# EAGLE design lp_propeller (EAGLE 6.6.0)
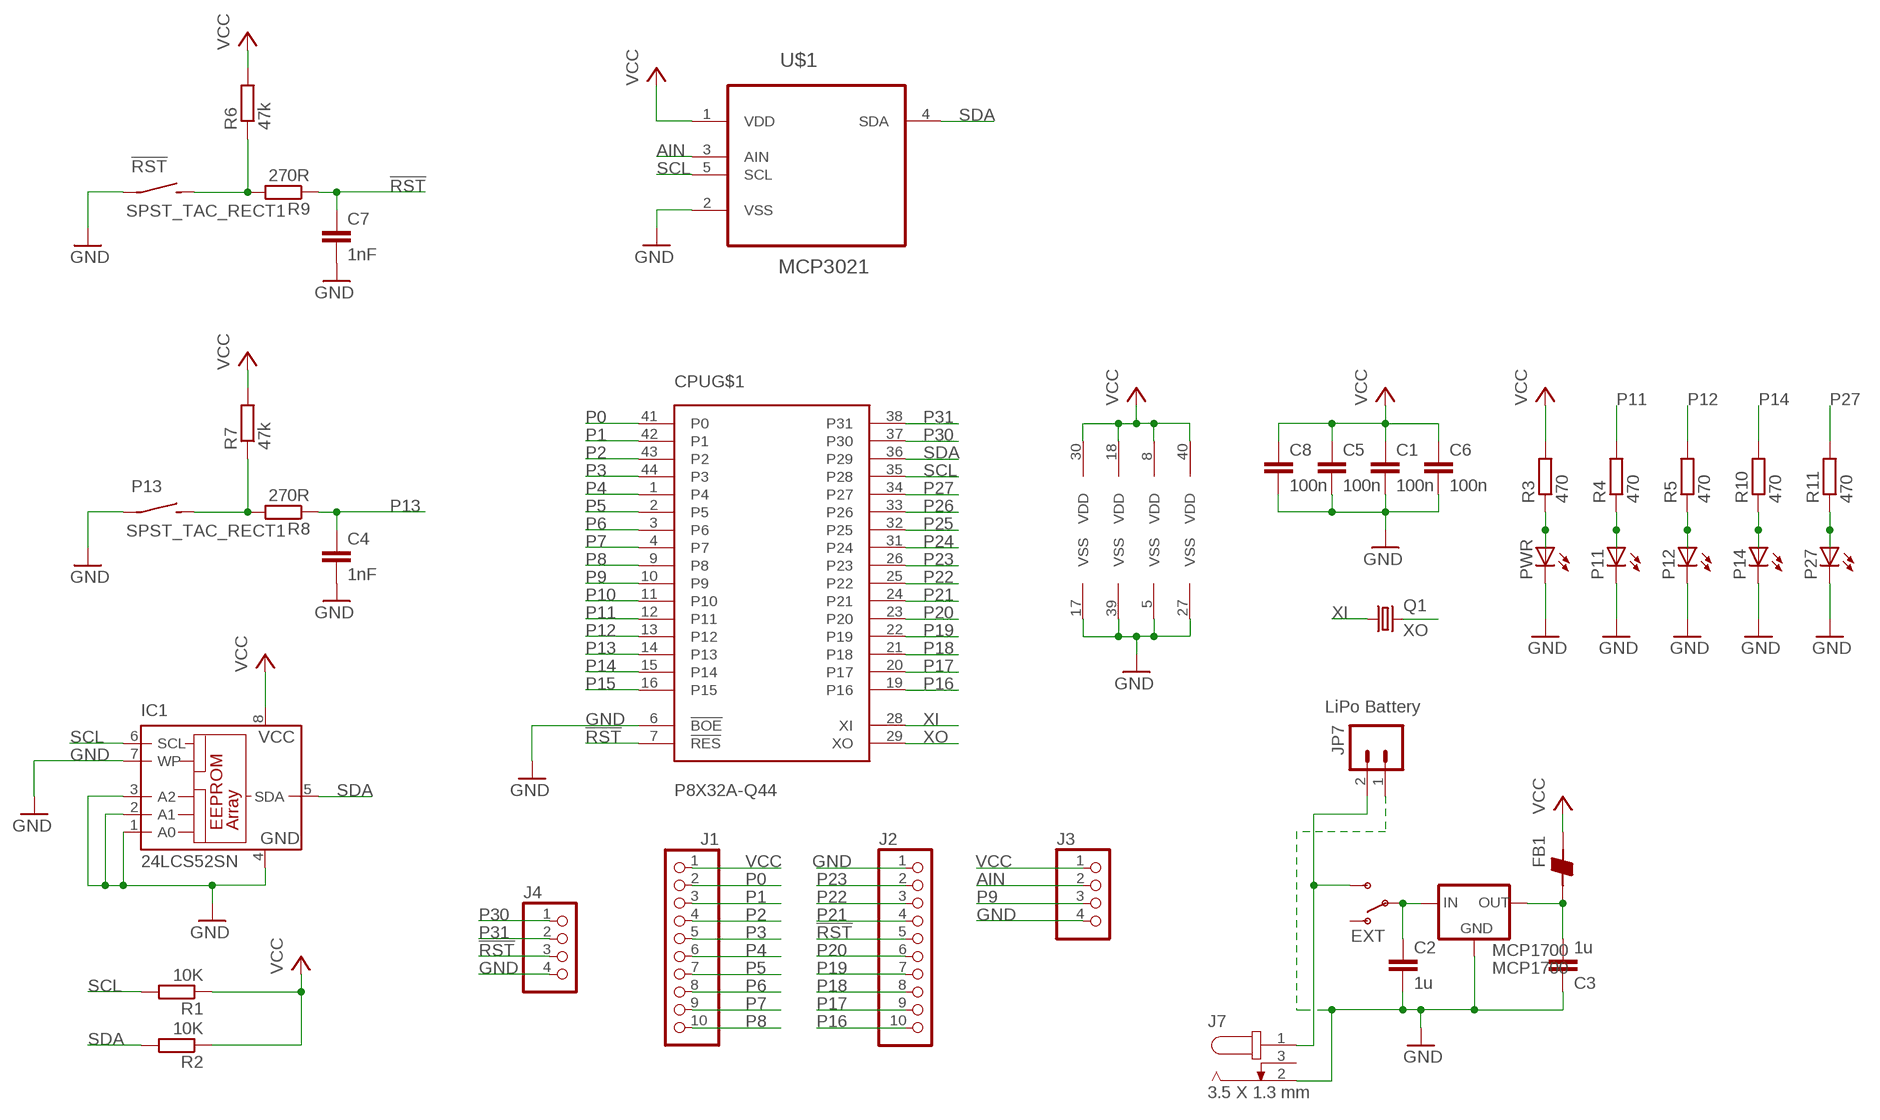
[diagram p0: schematic, sheet 1]

## Parts
!RST  SPST_TAC_RECT1  [6MMTACTILE_RECT]
C1  100n  C-EUC0805  [C0805]
C2  1u  C-EUC0805  [C0805]
C3  1u  C-EUC0805  [C0805]
C4  1nF  C-EUC0805  [C0805]
C5  100n  C-EUC0805  [C0805]
C6  100n  C-EUC0805  [C0805]
C7  1nF  C-EUC0805  [C0805]
C8  100n  C-EUC0805  [C0805]
CPU  P8X32A-Q44  [LQFP-44]
FB1  BEAD-0805  [0805]
IC1  24LCS52SN  [SO-08]
J1  PH1X10OCT076  [PH1X10OCT76]
J2  PH1X10OCT076  [PH1X10OCT76]
J3  PINHD-1X4  [1X04]
J4  PINHD-1X4  [1X04]
J7  3.5 X 1.3 mm  DC_JACK_3.5X1.3MM  [3.5X1.3MM_DC_JACK]
JP7  LiPo Battery  M02JST-PTH-2  [JST-2-PTH]
MCP1700  MCP1700  MCP1700SOT-23  [SOT-23]
ON  EXT  SWITCH-SPSTPTH  [SWITCH-SPDT]
P11  LEDCHIPLED_1206  [CHIPLED_1206]
P12  LEDCHIPLED_1206  [CHIPLED_1206]
P13  SPST_TAC_RECT1  [6MMTACTILE_RECT]
P14  LEDCHIPLED_1206  [CHIPLED_1206]
P27  LEDCHIPLED_1206  [CHIPLED_1206]
PWR  LEDCHIPLED_1206  [CHIPLED_1206]
Q1  CRYSTALHC49S  [HC49/S]
R1  10K  R-EU_R0805  [R0805]
R2  10K  R-EU_R0805  [R0805]
R3  470  R-EU_R0805  [R0805]
R4  470  R-EU_R0805  [R0805]
R5  470  R-EU_R0805  [R0805]
R6  47k  R-EU_R0805  [R0805]
R7  47k  R-EU_R0805  [R0805]
R8  270R  R-EU_R0805  [R0805]
R9  270R  R-EU_R0805  [R0805]
R10  470  R-EU_R0805  [R0805]
R11  470  R-EU_R0805  [R0805]
U$1  MCP3021  MCP3021A5T-E/OT  [SOT95P270X145-5N]

## Nets
!RST: C7.1 CPU.7(!RES) J2.5 J4.3 R9.1
AIN: J3.2 U$1.3(AIN)
GND [GND]: !RST.P$1(P) C1.2 C2.2 C3.1 C4.2 C5.2 C6.2 C7.2 C8.2 CPU.5(VSS) CPU.6(!BOE) CPU.17(VSS) CPU.27(VSS) CPU.39(VSS) IC1.1(A0) IC1.2(A1) IC1.3(A2) IC1.4(GND) IC1.7(WP) J2.1 J3.4 J4.4 J7.2 JP7.1 MCP1700.1(GND) P11.C P12.C P13.P$1(P) P14.C P27.C PWR.C U$1.2(VSS)
N$1: P14.A R10.1
N$2: P27.A R11.1
N$3 [VCC]: C2.1 MCP1700.3(IN) ON.2(P)
N$4: PWR.A R3.1
N$5: P13.P$2(S) R7.1 R8.2
N$6 [VCC]: C3.2 FB1.1 MCP1700.2(OUT)
N$9: P11.A R4.1
N$10: P12.A R5.1
N$11: !RST.P$2(S) R6.1 R9.2
P0: CPU.41(P0) J1.2
P1: CPU.42(P1) J1.3
P2: CPU.43(P2) J1.4
P3: CPU.44(P3) J1.5
P4: CPU.1(P4) J1.6
P5: CPU.2(P5) J1.7
P6: CPU.3(P6) J1.8
P7: CPU.4(P7) J1.9
P8: CPU.9(P8) J1.10
P9: CPU.10(P9) J3.3
P10: CPU.11(P10)
P11: CPU.12(P11) R4.2
P12: CPU.13(P12) R5.2
P13: C4.1 CPU.14(P13) R8.1
P14: CPU.15(P14) R10.2
P15: CPU.16(P15)
P16: CPU.19(P16) J2.10
P17: CPU.20(P17) J2.9
P18: CPU.21(P18) J2.8
P19: CPU.22(P19) J2.7
P20: CPU.23(P20) J2.6
P21: CPU.24(P21) J2.4
P22: CPU.25(P22) J2.3
P23: CPU.26(P23) J2.2
P24: CPU.31(P24)
P25: CPU.32(P25)
P26: CPU.33(P26)
P27: CPU.34(P27) R11.2
P30: CPU.37(P30) J4.1
P31: CPU.38(P31) J4.2
SCL: CPU.35(P28) IC1.6(SCL) R1.2 U$1.5(SCL)
SDA: CPU.36(P29) IC1.5(SDA) R2.2 U$1.4(SDA)
VCC [VCC]: C1.1 C5.1 C6.1 C8.1 CPU.8(VDD) CPU.18(VDD) CPU.30(VDD) CPU.40(VDD) FB1.2 IC1.8(VCC) J1.1 J3.1 R1.1 R2.1 R3.2 R6.2 R7.2 U$1.1(VDD)
VCCEXT [VCC]: J7.1 JP7.2 ON.3(S)
XI: CPU.28(XI) Q1.1
XO: CPU.29(XO) Q1.2
Unconnected: J7.3 ON.1(O)

## Library data of the parts
!RST P13 = bt_electromech:SPST: SPST SWITCH
C1-C3 C5 C6 C8 = rcl:C-EU: CAPACITOR, European symbol
C4 C7 = resistor:C-EU: CAPACITOR, European symbol
CPU = parallax_propeller:P8X32A-Q44: Parallax Propeller P8X32A-Q44 44 Pin LQFP 32-bit Microprocessor http://www.parallax.com/propeller/
FB1 = CH_passive:BEAD
IC1 = microchip:24*: Serial EEPROM I2C; MF: MICROCHIP; MPN: 24LCS52-I/SN; OC_FARNELL: 1816066; OC_NEWARK: 92C7032
J1 J2 = MY_CONN:PH1X10
J3 J4 = pinhead:PINHD-1X4: PIN HEADER
J7 = MY_CONN:DC_JACK_3.5X1.3MM
JP7 = SparkFun:M02: Header 2 Standard 2-pin 0.1" header. Use with straight break away headers (SKU : PRT-00116), right angle break away headers (PRT-00553), swiss pins (PRT-00743), machine pins (PRT-00117), and female headers (PRT-00115). Molex polarized connector foot print use with SKU : PRT-08233 with associated crimp pins and housings.
MCP1700 = MY_IC:MCP1700
ON = SparkFun:SWITCH-SPST: SPST Switch Simple slide switch. Spark Fun Electronics SKU : COM-00102
P11 P12 P14 P27 PWR = led:LED: LED OSRAM: - CHIPLED LG R971, LG N971, LY N971, LG Q971, LY Q971, LO R971, LY R971 LH N974, LH R974 LS Q976, LO Q976, LY Q976 LO Q996 - Hyper CHIPLED LW Q18S LB Q993, LB Q99A, LB R99A - SideLED LS A670, LO A670, LY A670, LG A670, LP A670 LB A673, LV A673, LT A673, LW A673 LH A674 LY A675 LS A676, LA A676, LO A676, LY A676, LW A676 LS A679, LY A679, LG A679 - Hyper Micro SIDELED® LS Y876, LA Y876, LO Y876, LY Y876 LT Y87S - SmartLED LW L88C, LW L88S LB L89C, LB L89S, LG L890 LS L89K, LO L89K, LY L89K LS L896, LA L896, LO L896, LY L896 - TOPLED LS T670, LO T670, LY T670, LG T670, LP T670 LSG T670, LSP T670, LSY T670, LOP T670, LYG T670 LG T671, LOG T671, LSG T671 LB T673, LV T673, LT T673, LW T673 LH T674 LS T676, LA T676, LO T676, LY T676, LB T676, LH T676, LSB T676, LW T676 LB T67C, LV T67C, LT T67C, LS T67K, LO T67K, LY T67K, LW E67C LS E67B, LA E67B, LO E67B, LY E67B, LB E67C, LV E67C, LT E67C LW T67C LS T679, LY T679, LG T679 LS T770, LO T770, LY T770, LG T770, LP T770 LB T773, LV T773, LT T773, LW T773 LH T774 LS E675, LA E675, LY E675, LS T675 LS T776, LA T776, LO T776, LY T776, LB T776 LHGB T686 LT T68C, LB T68C - Hyper Mini TOPLED® LB M676 - Mini TOPLED Santana® LG M470 LS M47K, LO M47K, LY M47K Source: http://www.osram.convergy.de LUXEON: - LUMILED® LXK2-PW12-R00, LXK2-PW12-S00, LXK2-PW14-U00, LXK2-PW14-V00 LXK2-PM12-R00, LXK2-PM12-S00, LXK2-PM14-U00 LXK2-PE12-Q00, LXK2-PE12-R00, LXK2-PE12-S00, LXK2-PE14-T00, LXK2-PE14-U00 LXK2-PB12-K00, LXK2-PB12-L00, LXK2-PB12-M00, LXK2-PB14-N00, LXK2-PB14-P00, LXK2-PB14-Q00 LXK2-PR12-L00, LXK2-PR12-M00, LXK2-PR14-Q00, LXK2-PR14-R00 LXK2-PD12-Q00, LXK2-PD12-R00, LXK2-PD12-S00 LXK2-PH12-R00, LXK2-PH12-S00 LXK2-PL12-P00, LXK2-PL12-Q00, LXK2-PL12-R00 Source: www.luxeon.com KINGBRIGHT: KA-3528ASYC Source: www.kingbright.com
Q1 = crystal:CRYSTAL: CRYSTAL; OC_FARNELL: 1667008; OC_NEWARK: unknown
R1-R11 = resistor:R-EU_: RESISTOR, European symbol
U$1 = thierry_eagle:MCP3021A5T-E/OT: A/D Converter; MPN: MCP3021A5T-E/OT; OC_FARNELL: 1332097; OC_NEWARK: 34M7445; PACKAGE: SOT-5; SUPPLIER: Microchip

## Net classes
0 default: width 0.406 mm, drill 0.508 mm
1 GND: width 0.508 mm, drill 0.508 mm
2 VCC: width 1.016 mm, drill 0.508 mm
4 VCCEXT: width 0.762 mm, drill 0.508 mm

## Board
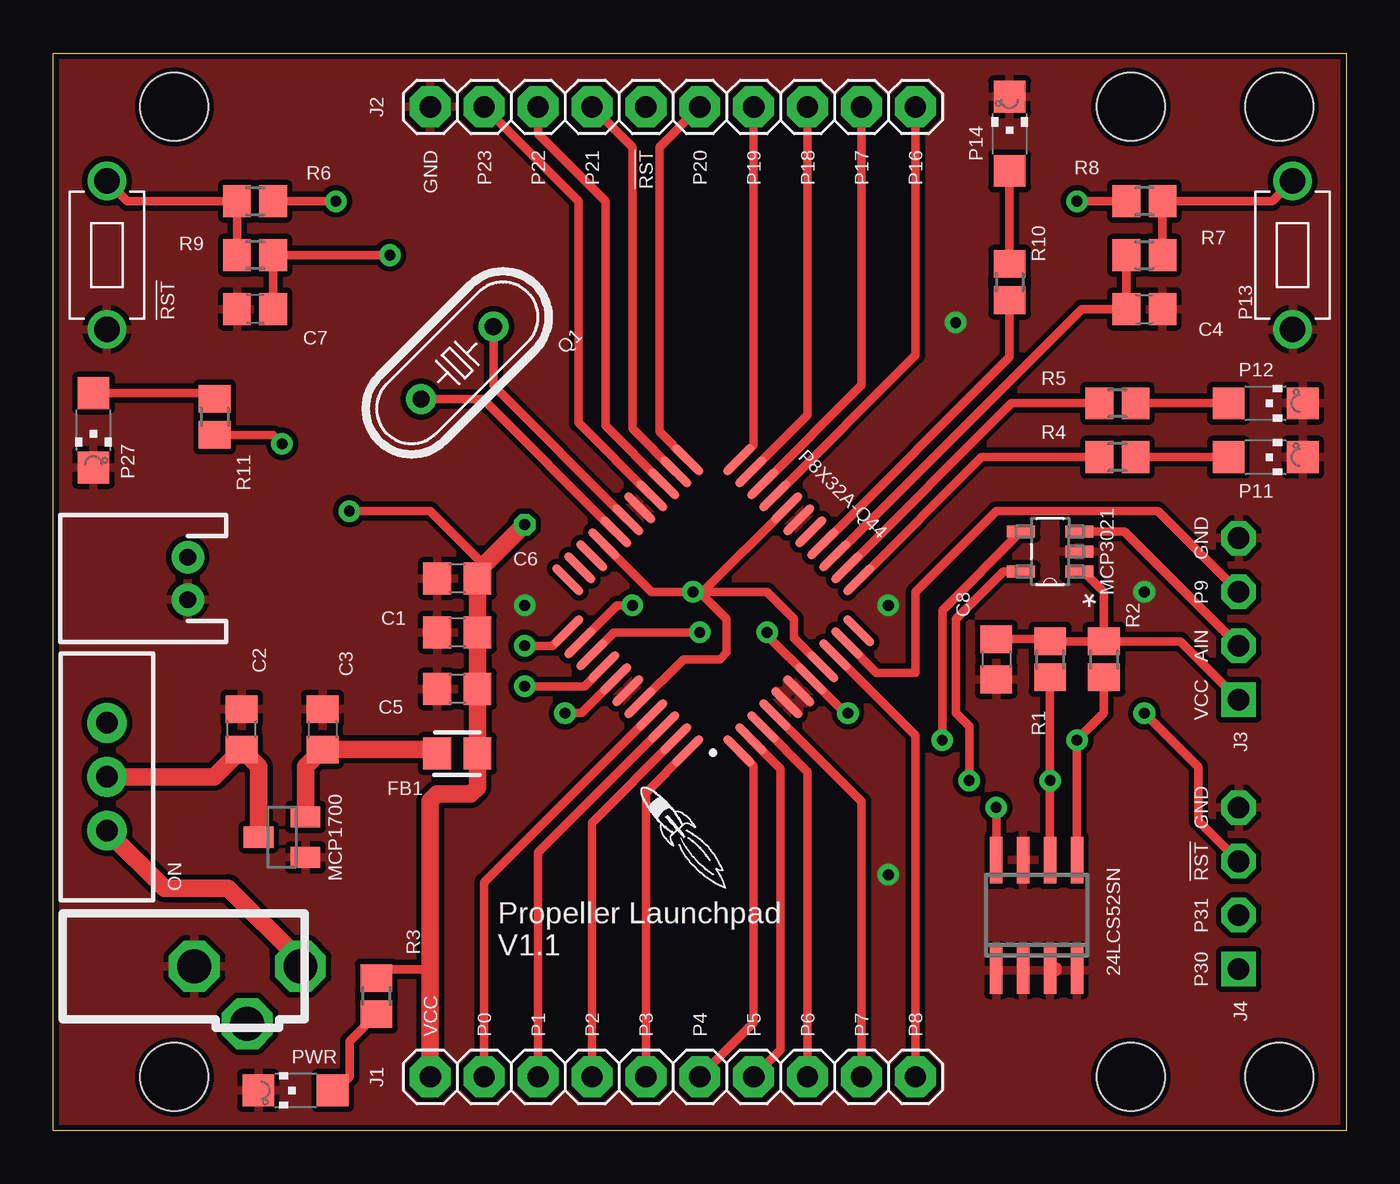
[diagram p1: board, top side]
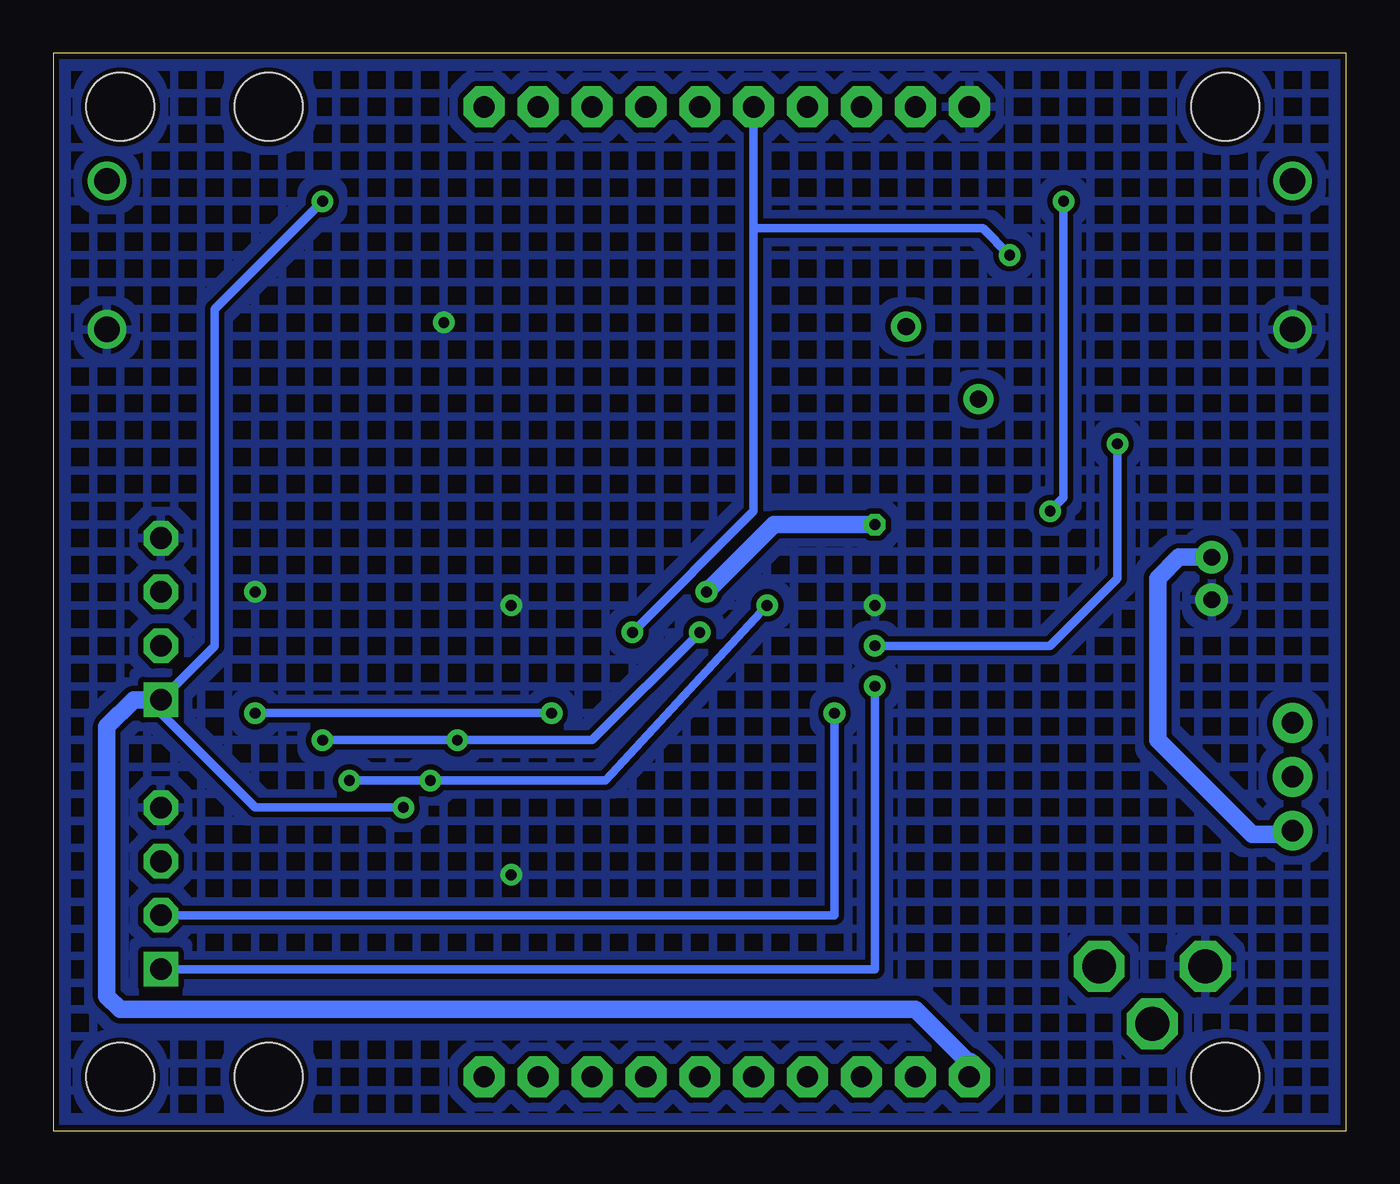
[diagram p2: board, bottom side, seen from below]

Size 60.96 x 50.8 mm. Coordinates in mm from the lower left corner, seen from the top.
Outline: 0,50.8 60.96,50.8 60.96,0 0,0 0,50.8
Copper layers (1*16): Top 0.035mm / dielectric 1.5mm / Bottom 0.035mm
Design rules "SparkFun *": minimum track width 8mil, minimum drill 20mil, track to track 7mil, track to pad 7mil, pad to pad 7mil, via to via 7mil, smd to smd 7mil, copper to edge 7mil, drill to drill 7mil, minimum pad ring 12mil, minimum via ring 10mil, stop-mask expansion 4mil, vias tented up to drill 25mil, thermal gap 10mil
Holes 3.2 mm at 5.71,48.26 50.8,48.26 50.8,2.54 5.71,2.54 57.79,2.54 57.79,48.26

### Footprints (pad centres in the part's own frame; a part is rotated, then mirrored left to right if it is on the bottom)
6MMTACTILE_RECT = drill 1.2: P$1 -3.5,0; P$2 3.5,0
C0805 = smd 1.3 x 1.5: 1 -0.95,0; 2 0.95,0
C0805' = smd 1.3 x 1.5: 1 -0.85,0; 2 0.85,0
LQFP-44 = smd 1.9 x 0.4: 1 -5.7,4; 2 -5.7,3.2; 3 -5.7,2.4; 4 -5.7,1.6; 5 -5.7,0.8; 6 -5.7,0; 7 -5.7,-0.8; 8 -5.7,-1.6; 9 -5.7,-2.4; 10 -5.7,-3.2; 11 -5.7,-4; 23 5.7,-4; 24 5.7,-3.2; 25 5.7,-2.4; 26 5.7,-1.6; 27 5.7,-0.8; 28 5.7,0; 29 5.7,0.8; 30 5.7,1.6; 31 5.7,2.4; 32 5.7,3.2; 33 5.7,4 | smd 0.4 x 1.9: 12 -4,-5.7; 13 -3.2,-5.7; 14 -2.4,-5.7; 15 -1.6,-5.7; 16 -0.8,-5.7; 17 0,-5.7; 18 0.8,-5.7; 19 1.6,-5.7; 20 2.4,-5.7; 21 3.2,-5.7; 22 4,-5.7; 34 4,5.7; 35 3.2,5.7; 36 2.4,5.7; 37 1.6,5.7; 38 0.8,5.7; 39 0,5.7; 40 -0.8,5.7; 41 -1.6,5.7; 42 -2.4,5.7; 43 -3.2,5.7; 44 -4,5.7
0805 = smd 1.3 x 1.5: 1 -0.95,0; 2 0.95,0
SO-08 = smd 0.6 x 2.2: 1 -1.905,-2.6; 2 -0.635,-2.6; 3 0.635,-2.6; 4 1.905,-2.6; 5 1.905,2.6; 6 0.635,2.6; 7 -0.635,2.6; 8 -1.905,2.6
PH1X10OCT76 = drill 1 pad 1.93 octagon: 1 0,0; 2 2.54,0; 3 5.08,0; 4 7.62,0; 5 10.16,0; 6 12.7,0; 7 15.24,0; 8 17.78,0; 9 20.32,0; 10 22.86,0
1X04 = drill 1.016 square: 1 -3.81,0 | drill 1.016 octagon: 2 -1.27,0; 3 1.27,0; 4 3.81,0
3.5X1.3MM_DC_JACK = drill 1.6 octagon: 1 0,0; 2 -5,0; 3 -2.5,-2.7
JST-2-PTH = drill 0.787 pad 1.524: 1 -1,0; 2 1,0
SOT-23 = smd 1 x 1.4: 1 -0.95,-1.1; 2 0.95,-1.1; 3 0,1.1
SWITCH-SPDT = drill 1.016 pad 1.88: 1 0,2.54; 2 0,0; 3 0,-2.54
CHIPLED_1206 = smd 1.5 x 1.5: A 0,-1.75; C 0,1.75
HC49/S = drill 0.813: 1 -2.413,0; 2 2.413,0
R0805 = smd 1.3 x 1.5: 1 -0.85,0; 2 0.85,0
SOT95P270X145-5N = smd 1.321 x 0.559: 1 -1.372,0.94; 2 -1.372,0; 3 -1.372,-0.94; 4 1.372,-0.94; 5 1.372,0.94

### Placement (x,y rotation side)
!RST  2.54,41.27 90 top
C1  19.05,20.83 180 top
C2  8.89,18.92 90 top
C3  12.7,18.92 270 top
C4  1nF  [C0805']  51.43,38.73 0 top
C5  19.05,23.49 180 top
C6  19.05,26.04 180 top
C7  1nF  [C0805']  9.52,38.73 180 top
C8  44.45,22.22 270 top
CPU  31.12,24.76 135 top
FB1  19.05,17.78 0 top
IC1  46.35,10.16 0 top
J1  17.78,2.54 0 top
J2  17.78,48.26 0 top
J3  55.88,24.13 90 top
J4  55.88,11.43 90 top
J7  11.66,7.75 0 top
JP7  6.35,26.04 90 top
MCP1700  10.8,13.84 90 top
ON  2.54,16.69 0 top
P11  57.15,31.75 270 top
P12  57.15,34.29 270 top
P13  58.42,41.27 90 top
P14  45.09,46.99 0 top
P27  1.9,33.02 180 top
PWR  11.43,1.91 90 top
Q1  19.05,36.2 225 top
R1  46.99,22.22 270 top
R2  49.53,22.22 270 top
R3  15.24,6.35 90 top
R4  50.16,31.75 180 top
R5  50.16,34.29 180 top
R6  9.52,43.82 0 top
R7  51.43,43.82 180 top
R8  51.43,41.27 0 top
R9  9.52,41.27 180 top
R10  45.09,40.01 270 top
R11  7.62,33.66 270 top
U$1  46.99,27.3 180 top
U$2  [LOGO-ROCKET]  29.53,13.97 90 top

### Tracks (layer width: path | path; a pad name or v marks a point on that pad's centre or on a via)
!RST  (via drill 0.51)
  Top 0.406: C7.1 R9.1 v15.88,41.27 | v33.66,23.49 33.66,23.36 CPU.7 37.33,19.68 v37.46,19.68 | v51.43,19.68 53.98,17.14 53.98,14.61 J4.3
  Bottom 0.406: v33.66,23.49 27.94,29.21 27.94,42.55 | 27.94,42.55 J2.5 | v15.88,41.27 17.14,42.55 27.94,42.55 | v37.46,19.68 v51.43,19.68
AIN
  Top 0.406: J3.2 50.49,28.24 U$1.3
GND  (via drill 0.51)
  Top 0.508: 47.27,7.56 47.27,7.7 IC1.3
  other vias: 39.37,12.06 22.23,24.76 39.37,24.76 51.43,25.4 42.54,38.1
  pour Top (isolate 0.254): -0.89,-0.51 61.98,-0.51 61.98,51.31 -0.89,51.31
  pour Bottom (isolate 0.254, hatched): -0.89,-0.51 61.98,-0.51 61.98,51.31 -0.89,51.31
N$1
  Top 0.406: R10.1 P14.A
N$2
  Top 0.406: R11.1 7.35,34.77 P27.A
N$3
  Top 0.813: MCP1700.3 9.7,17.17 C2.1 7.6,16.69 ON.2
N$4
  Top 0.406: R3.1 13.97,4.23 13.97,2.54 13.34,1.91 PWR.A
N$5
  Top 0.406: P13.P$2 57.46,43.82 R7.1 R8.2
N$6
  Top 0.813: 17.91,17.97 C3.2 11.89,17.17 MCP1700.2
  Top 1.016: FB1.1 17.91,17.97
N$9
  Top 0.406: R4.1 P11.A
N$10
  Top 0.406: R5.1 P12.A
N$11
  Top 0.406: !RST.P$2 3.5,43.82 R6.1 R9.2
P0
  Top 0.406: CPU.41 20.32,11.71 J1.2
P1
  Top 0.406: CPU.42 22.86,13.12 J1.3
P2
  Top 0.406: CPU.43 25.4,14.53 J1.4
P3
  Top 0.406: CPU.44 27.94,15.93 J1.5
P4
  Top 0.406: CPU.1 33.02,17.2 33.02,5.08 J1.6
P5
  Top 0.406: CPU.2 34.29,17.06 34.29,3.81 J1.7
P6
  Top 0.406: CPU.3 35.56,16.93 J1.8
P7
  Top 0.406: CPU.4 38.1,15.52 J1.9
P8
  Top 0.406: CPU.9 40.64,18.63 J1.10
P9
  Top 0.406: CPU.10 38.81,21.59 40.64,21.59 40.64,25.4 44.45,29.21 52.07,29.21 J3.3
P11
  Top 0.406: CPU.12 43.76,31.75 R4.2
P12
  Top 0.406: CPU.13 45.16,34.29 R5.2
P13
  Top 0.406: R8.1 C4.1 48.48,38.73 CPU.14
P14
  Top 0.406: CPU.15 45.09,36.47 R10.2
P16
  Top 0.406: CPU.19 40.64,36.55 J2.10
P17
  Top 0.406: CPU.20 38.1,35.14 J2.9
P18
  Top 0.406: CPU.21 35.56,33.73 J2.8
P19
  Top 0.406: CPU.22 33.02,32.33 J2.7
P20
  Top 0.406: CPU.23 28.57,32.96 28.57,46.36 J2.6
P21
  Top 0.406: CPU.24 27.3,33.1 27.3,46.36 J2.4
P22
  Top 0.406: CPU.25 26.03,33.24 26.03,43.82 22.86,46.99 J2.3
P23
  Top 0.406: CPU.26 24.77,33.38 24.77,43.82 J2.2
P27  (via drill 0.51)
  Top 0.406: CPU.34 23.55,22.86 v22.23,22.86 | v10.8,32.39 10.38,32.8 R11.2
  Bottom 0.406: v22.23,22.86 13.97,22.86 10.8,26.04 v10.8,32.39
P30  (via drill 0.51)
  Top 0.406: CPU.37 25.04,20.95 v22.23,20.95
  Bottom 0.406: v22.23,20.95 22.23,7.62 J4.1
P31  (via drill 0.51)
  Top 0.406: CPU.38 24.9,19.68 v24.13,19.68
  Bottom 0.406: v24.13,19.68 24.13,10.16 J4.2
SCL  (via drill 0.51)
  Top 0.406: CPU.35 26.59,24.76 v27.3,24.76 | IC1.6 v46.99,16.51 R1.2 | U$1.5 44.78,26.36 42.54,24.13 42.54,19.68 43.18,19.05 v43.18,16.51
  Bottom 0.406: v27.3,24.76 34.92,16.51 v43.18,16.51 v46.99,16.51
SDA  (via drill 0.51)
  Top 0.406: IC1.5 v48.26,18.41 49.53,19.68 R2.2 | CPU.36 26.45,23.49 v30.48,23.49 | U$1.4 41.91,24.54 v41.91,18.41
  Bottom 0.406: v30.48,23.49 35.56,18.41 v41.91,18.41 v48.26,18.41
VCC  (via drill 0.51)
  Top 0.406: C6.1 20.32,26.04 20.32,26.67 17.78,29.21 v13.97,29.21 | R2.1 53.12,23.07 J3.1 | R2.1 R1.1 46.89,23.17 C8.1 | v13.34,43.82 R6.2 | R3.2 15.66,7.62 17.78,7.62 | R7.2 v48.26,43.82 | IC1.8 v44.45,15.24 | R2.1 49.53,25.4 48.57,26.36 U$1.1 | CPU.40 29.71,22.22 31.43,22.22 31.75,22.54 31.75,24.13 30.48,25.4 v30.16,25.4 | CPU.18 30.62,25.4 v30.16,25.4 | CPU.30 28.22,25.4 v30.16,25.4 | CPU.8 34.92,23.22 34.92,24.13 33.66,25.4 v30.16,25.4
  Top 0.813: C6.1 C5.1 C1.1 FB1.2 20,16.19 19.68,15.88 18.09,15.88 17.78,15.56 17.78,7.62 J1.1 | 20.32,26.67 v22.23,28.57
  Bottom 0.406: v13.97,29.21 13.34,29.84 v13.34,43.82 | v48.26,43.82 53.34,38.73 53.34,22.86 J3.1 55.88,19.68 51.43,15.24 v44.45,15.24
  Bottom 0.813: 17.78,3.17 20.32,5.71 57.79,5.71 58.42,6.35 58.42,19.05 57.15,20.32 J3.1 | v22.23,28.57 26.99,28.57 v30.16,25.4
  Bottom 1.016: 17.78,3.17 J1.1
VCCEXT
  Top 0.813: ON.3 5.26,11.43 8.25,11.43 11.66,8.03
  Top 1.016: 11.66,8.03 J7.1
  Bottom 0.813: 2.72,13.97 4.45,13.97 8.89,18.41 8.89,26.04 7.89,27.04 JP7.2
  Bottom 1.016: ON.3 2.72,13.97
XI
  Top 0.406: CPU.28 20.76,35.12 Q1.1
XO
  Top 0.406: CPU.29 20.26,34.49 Q1.2

### Text on the board
tPlace: GND | MCP3021 | P9 | AIN | VCC | GND | !RST | P31 | Propeller Launchpad / V1.1 | P30
tNames: GND | P23 | P22 | P21 | !RST | P20 | P19 | P18 | P17 | P16 | ON | VCC | P0 | P1 | P2 | P3 | P4 | P5 | P6 | P7 | P8